# EAGLE schematic TeamFlag (EAGLE 9.4.2)
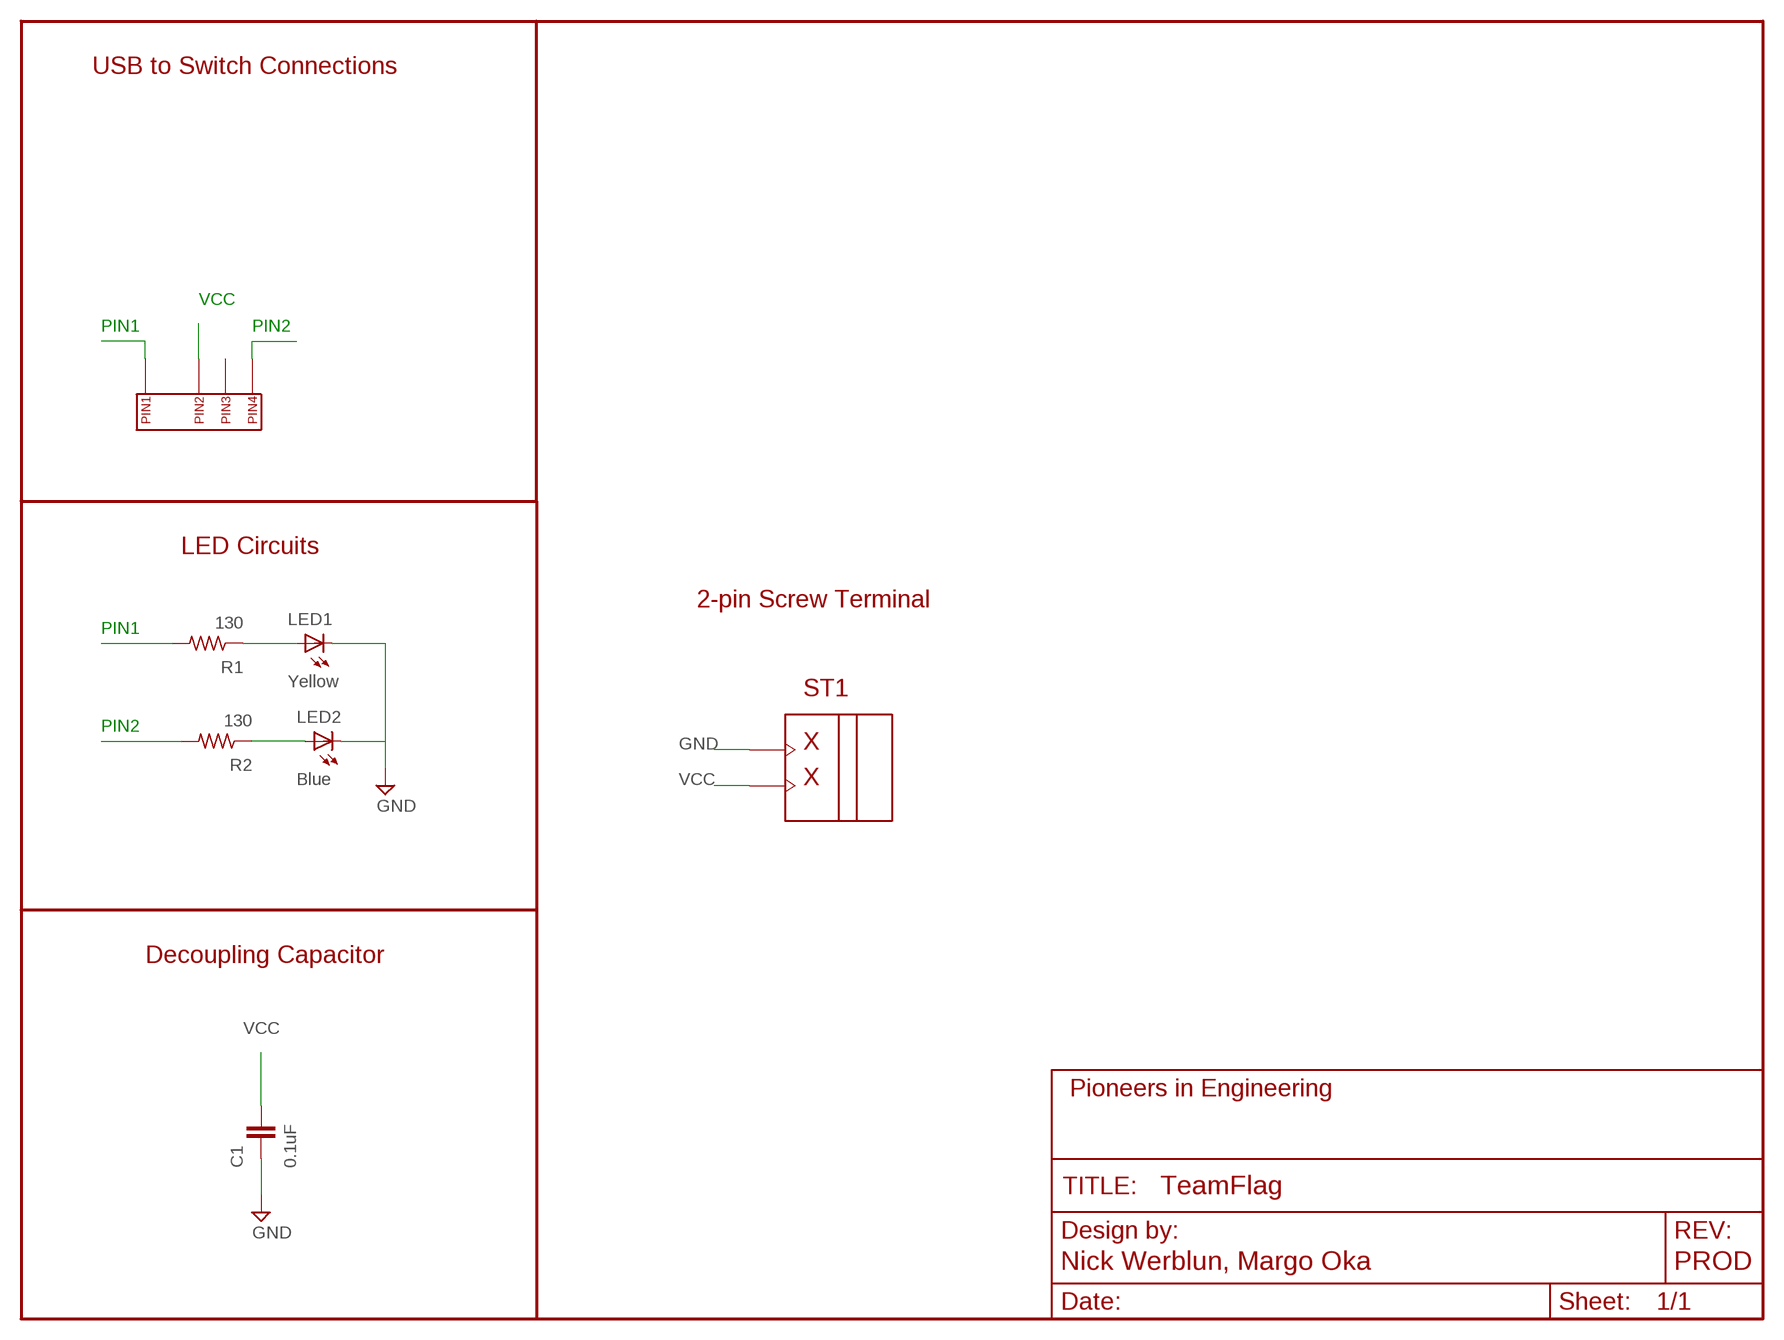
[diagram p0: schematic, sheet 1]
FRAME1 (FRAME_SCHEMATIC): AUTHOR: Nick Werblun, Margo Oka; REVISION: PROD

## Parts
C1  0.1uF  CAP0603-CAP  [0603-CAP]
LED1  Yellow  LEDLED5MM-NOFLAT  [LED5MM-NOFLAT]
LED2  Blue  LEDLED5MM-NOFLAT  [LED5MM-NOFLAT]
R1  130  R-US_R0603  [R0603]
R2  130  R-US_R0603  [R0603]
ST1  2PIN_SCREW  [2PIN_SCREW]
U$2  SP3T_SLIDE_SWITCH  [SP3T_SLIDE_SWITCH]

## Nets
GND: C1.1 LED1.K(C) LED2.K(C) ST1.P$1
N$2: LED1.A R1.1
N$3: LED2.A R2.1
PIN1: R1.2 U$2.PIN1
PIN4: R2.2 U$2.PIN4
VCC: C1.2 ST1.P$2 U$2.PIN2
Unconnected: U$2.PIN3

## Notes on the sheet
- USB to Switch Connections
- PIN1 | PIN2
- LED Circuits
- 2-pin Screw Terminal
- PIN1
- PIN2
- Decoupling Capacitor

## Library data of the parts
C1 = pie:CAP: Capacitor Standard 0603 ceramic capacitor, and 0.1" leaded capacitor.; PIE-INT-REF-NUM: CAPACITOR-GENERIC
LED1 LED2 = pie:LED: LEDs Standard schematic elements and footprints for 5mm, 3mm, 1206, and 0603 sized LEDs. 5mm - Spark Fun Electronics SKU : COM-00529 (and others); PIE-INT-REF-NUM: LED
R1 R2 = pie:R-US_: RESISTOR, American symbol; DESCRIPTION: RESISTOR, American symbol; DISTRIBUTOR: DigiKey; MANUFACTURER: Rohm Semiconductor; NOTES: Cut Tape; PACKAGE: R0603; VALUE: >VALUE
ST1 = pie:2PIN_SCREW: 2 Pin Screw Terminal Sparkfun Page <https://www.sparkfun.com/products/8432> 5mm Pitch
U$2 = pie:SP3T_SLIDE_SWITCH: Single pole triple throw with slide switch